# Altium schematic sheet Sheet1.SchDoc
size A2
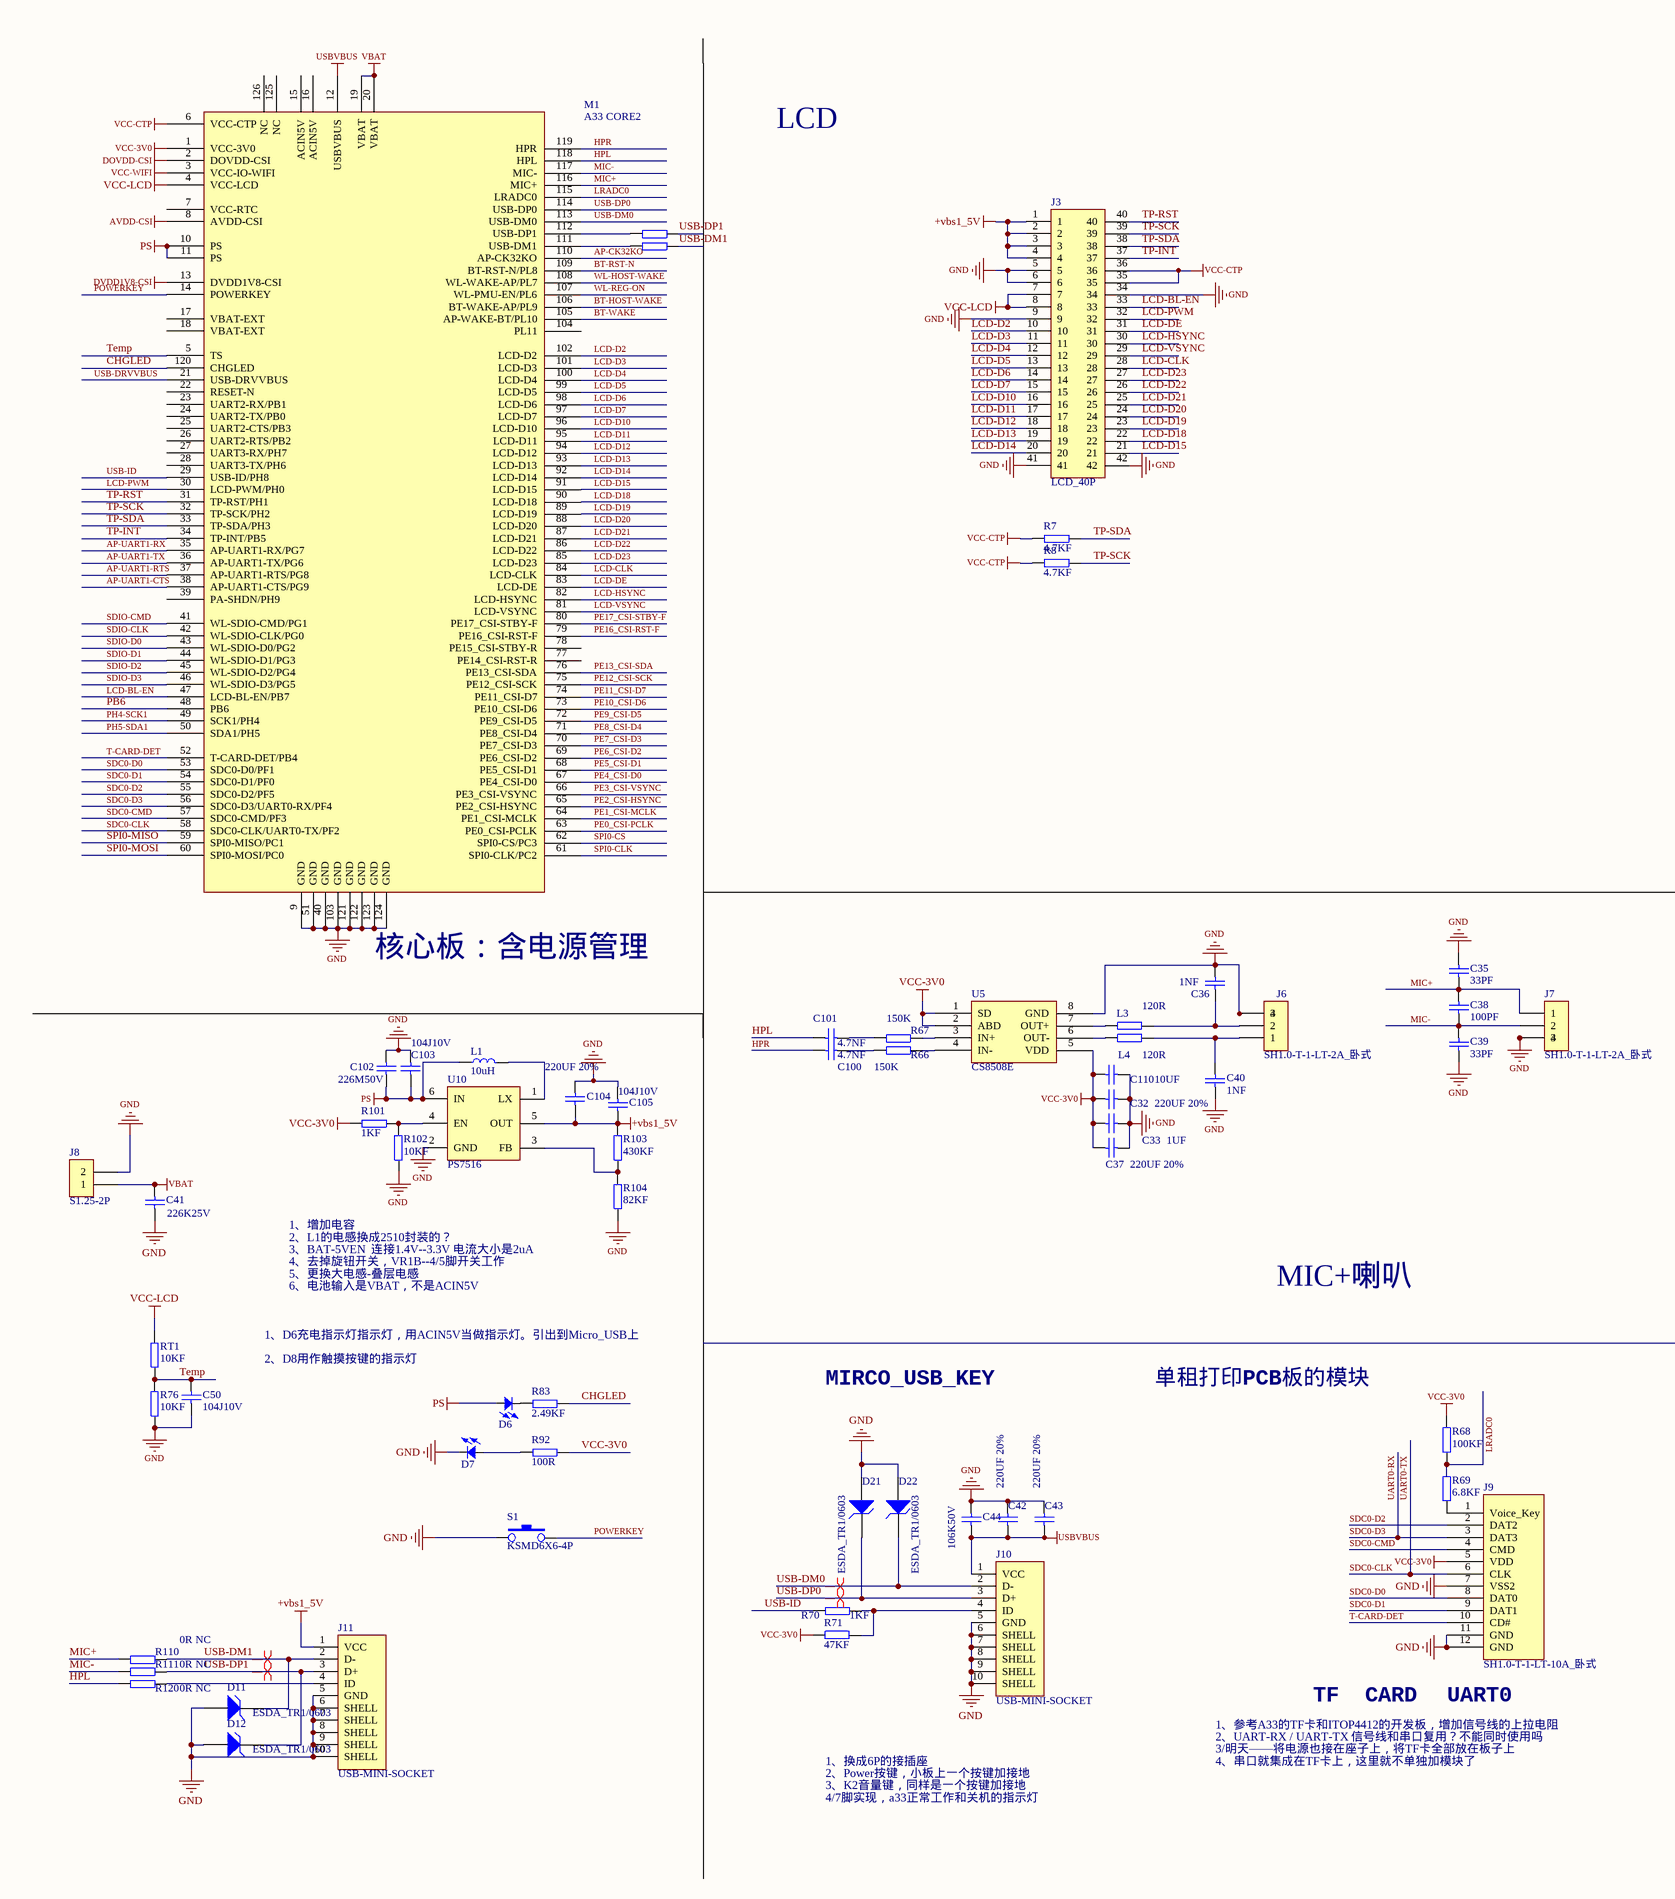
[diagram p0: Sheet1.SchDoc, left]
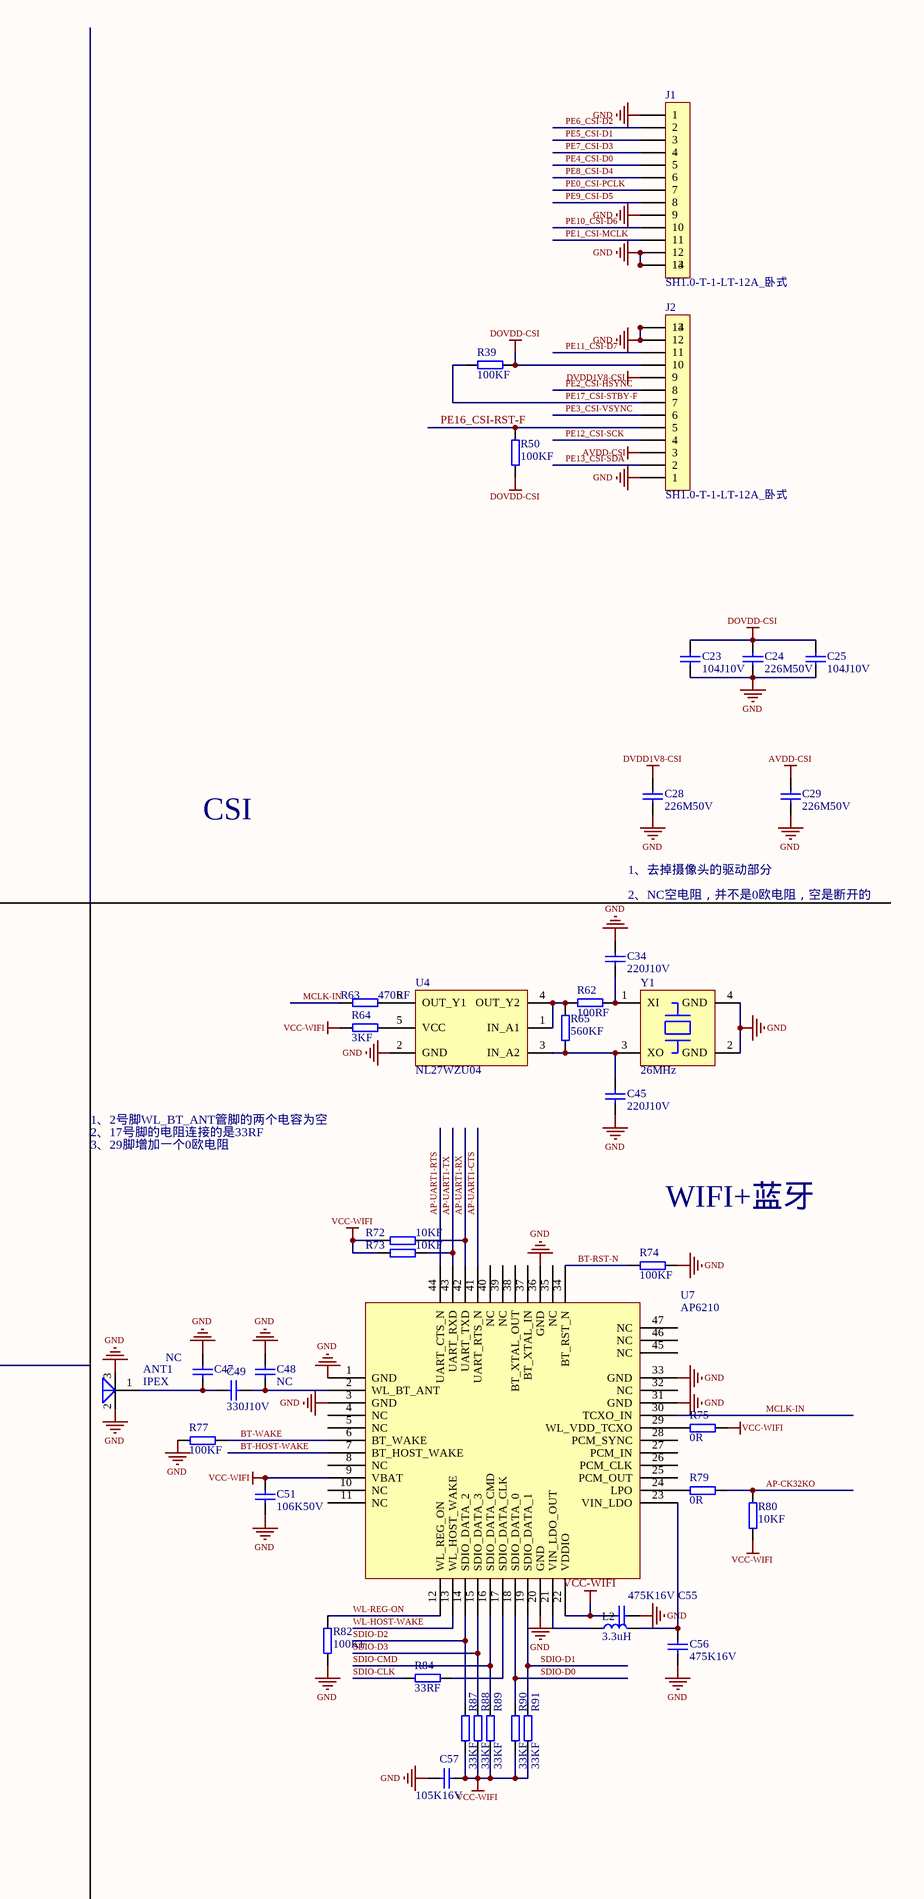
[diagram p1: Sheet1.SchDoc, right]

## Parts
ANT1  IPEX  [J-IPEX]
C23  104J10V  [C0402]
C24  226M50V  [C0805]
C25  104J10V  [C0402]
C28  226M50V  [C0805]
C29  226M50V  [C0805]
C32  220UF 20%  [C1206]
C33  1UF  [C0402]
C34  220J10V  [C0402]
C35  33PF  [C0402]
C36  1NF  [C0402]
C37  220UF 20%  [C1206]
C38  100PF  [C0402]
C39  33PF  [C0402]
C40  1NF  [C0402]
C41  226K25V  [C0805]
C42  220UF 20%  [C1206]
C43  220UF 20%  [C1206]
C44  106K50V  [C0603]
C45  220J10V  [C0402]
C47  NC  [C0402]
C48  NC  [C0402]
C49  330J10V  [C0402]
C50  104J10V  [C0402]
C51  106K50V  [C0603]
C55  475K16V  [C0603]
C56  475K16V  [C0603]
C57  105K16V  [C0603]
C100  4.7NF  [C0603]
C101  4.7NF  [C0603]
C102  226M50V  [C0805]
C103  104J10V  [C0402]
C104  220UF 20%  [C1206]
C105  104J10V  [C0402]
C110  10UF  [C0603]
D6  发光二极管  [LEDΦ5-H12]  (value not drawn)
D7  发光二极管  [LEDΦ5-H12]  (value not drawn)
D11  ESDA_TR1/0603  [HS_0603D]
D12  ESDA_TR1/0603  [HS_0603D]
D21  ESDA_TR1/0603  [HS_0603D]
D22  ESDA_TR1/0603  [HS_0603D]
J1  SH1.0-T-1-LT-12A_卧式  [J-SH1.0-T-1-LT-12A_卧式]
J2  SH1.0-T-1-LT-12A_卧式  [J-SH1.0-T-1-LT-12A_卧式]
J3  LCD_40P  [LCD P40]
J6  SH1.0-T-1-LT-2A_卧式  [J-SH1.0-T-1-LT-2A_卧式]
J7  SH1.0-T-1-LT-2A_卧式  [J-SH1.0-T-1-LT-2A_卧式]
J8  S1.25-2P  [S1.25-2P]
J9  SH1.0-T-1-LT-10A_卧式  [J-SH1.0-T-1-LT-10A_卧式]
J10  USB-MINI-SOCKET  [MICRO-USB - 5.9]
J11  USB-MINI-SOCKET  [MICRO-USB - 5.9]
L1  10uH  [L-2520]
L2  3.3uH  [L0805]
L3  120R  [R0603]
L4  120R  [R0603]
M1  A33 CORE2  [A33-CORE2]
R7  4.7KF  [R0402]
R8  4.7KF  [R0402]
R39  100KF  [R0603]
R50  100KF  [R0603]
R62  100RF  [R0603]
R63  470RF  [R0603]
R64  3KF  [R0603]
R65  560KF  [R0603]
R66  150K  [R0603]
R67  150K  [R0603]
R68  100KF  [R0603]
R69  6.8KF  [R0603]
R70  1KF  [R0603]
R71  47KF  [R0603]
R72  10KF  [R0603]
R73  10KF  [R0603]
R74  100KF  [R0603]
R75  0R  [R0603]
R76  10KF  [R0603]
R77  100KF  [R0603]
R79  0R  [R0603]
R80  10KF  [R0603]
R82  100KF  [R0603]
R83  2.49KF  [R0603]
R84  33RF  [R0603]
R87  33KF  [R0603]
R88  33KF  [R0603]
R89  33KF  [R0603]
R90  33KF  [R0603]
R91  33KF  [R0603]
R92  100R  [R0603]
R101  1KF  [R0603]
R102  10KF  [R0603]
R103  430KF  [R0603]
R104  82KF  [R0603]
R110  0R NC  [R0603]
R111  0R NC  [R0603]
R112  0R  NC  [R0603]  (value not drawn)
R113  0R  NC  [R0603]  (value not drawn)
R120  0R NC  [R0603]
RT1  10KF  [0402]
S1  KSMD6X6-4P  [SW2-6*6H]
U4  NL27WZU04  [U-TSOP-6]
U5  CS8508E  [SO-8]
U7  AP6210  [AP6210]
U10  PS7516  [U-SOT-23-6]
Y1  26MHz  [Y-CPX-32GA-4P]

## Nets
+vbs1_5V: C104.1 C105.2 J3.1 J3.2 J3.3 J3.4 J11.1(VCC) R103.2 U10.5(OUT)
AVDD-CSI: C29.1 J2.3 M1.8(AVDD-CSI)
DOVDD-CSI: C23.1 C24.1 C25.1 J2.10 M1.2(DOVDD-CSI) R39.2 R50.1
DVDD1V8-CSI: C28.1 J2.9 M1.13(DVDD1V8-CSI)
GND: ANT1.2 ANT1.3 C23.2 C24.2 C25.2 C28.2 C29.2 C32.1 C33.1 C34.2 C35.1 C36.2 C37.1 C39.2 C40.2 C41.2 C42.2 C43.2 C44.1 C45.2 C47.1 C48.1 C50.2 C51.2 C55.1 C56.1 C57.2 C102.2 C103.1 C104.2 C105.1 C110.2 D7.K D11.1(A) D12.1(A) D21.1(A) D22.1(A) J1.1 J1.9 J1.12 J1.13 J1.14 J2.1 J2.12 J2.13 J2.14 J3.5 J3.6 J3.9 J3.34 J3.41 J3.42 J6.3 J6.4 J7.3 J7.4 J8.2 J9.7(VSS2) J9.11(GND) J9.12(GND) J10.5(GND) J10.6(SHELL) J10.7(SHELL) J10.8(SHELL) J10.9(SHELL) J10.10(SHELL) J11.5(GND) J11.6(SHELL) J11.7(SHELL) J11.8(SHELL) J11.9(SHELL) J11.10(SHELL) M1.9(GND) M1.40(GND) M1.51(GND) M1.103(GND) M1.121(GND) M1.122(GND) M1.123(GND) M1.124(GND) R74.2 R76.1 R77.2 R82.2 R102.1 R104.1 S1.1 U4.2(GND) U5.8(GND) U7.1(GND) U7.3(GND) U7.20(GND) U7.31(GND) U7.33(GND) U7.36(GND) U10.2(GND) Y1.2(GND) Y1.4(GND)
PS: C102.1 C103.2 D6.A L1.1 M1.10(PS) M1.11(PS) U10.6(IN)
USBVBUS: C42.1 C43.1 C44.2 J10.1(VCC) M1.12(USBVBUS)
VBAT: C41.1 J8.1 M1.19(VBAT) M1.20(VBAT)
VCC-3V0: C32.2 C33.2 C37.2 C110.1 J9.5(VDD) M1.1(VCC-3V0) R68.1 R71.2 R92.2 R101.1 U5.1(SD) U5.2(ABD) U5.5(VDD)
VCC-CTP: J3.35 J3.36 M1.6(VCC-CTP) R7.1 R8.1
VCC-LCD: J3.7 J3.8 M1.4(VCC-LCD) RT1.2
VCC-WIFI: C51.1 C55.2 C57.1 M1.3(VCC-IO-WIFI) R64.1 R72.1 R73.1 R75.2 R80.1 R87.1 R88.1 R89.1 R90.1 R91.1 U7.9(VBAT) U7.22(VDDIO)
AP-CK32KO: M1.110(AP-CK32KO) R79.2 R80.2
AP-UART1-CTS: M1.38(AP-UART1-CTS/PG9) U7.41(UART_RTS_N)
AP-UART1-RTS: M1.37(AP-UART1-RTS/PG8) U7.44(UART_CTS_N)
AP-UART1-RX: M1.35(AP-UART1-RX/PG7) R72.2 U7.42(UART_TXD)
AP-UART1-TX: M1.36(AP-UART1-TX/PG6) R73.2 U7.43(UART_RXD)
BT-HOST-WAKE: M1.106(BT-WAKE-AP/PL9) U7.7(BT_HOST_WAKE)
BT-RST-N: M1.109(BT-RST-N/PL8) R74.1 U7.34(BT_RST_N)
BT-WAKE: M1.105(AP-WAKE-BT/PL10) R77.1 U7.6(BT_WAKE)
CHGLED: M1.120(CHGLED) R83.2
HPL: C101.1 M1.118(HPL) R120.1
HPR: C100.1 M1.119(HPR)
LCD-BL-EN: J3.33 M1.47(LCD-BL-EN/PB7)
LCD-CLK: J3.28 M1.84(LCD-CLK)
LCD-D2: J3.10 M1.102(LCD-D2)
LCD-D3: J3.11 M1.101(LCD-D3)
LCD-D4: J3.12 M1.100(LCD-D4)
LCD-D5: J3.13 M1.99(LCD-D5)
LCD-D6: J3.14 M1.98(LCD-D6)
LCD-D7: J3.15 M1.97(LCD-D7)
LCD-D10: J3.16 M1.96(LCD-D10)
LCD-D11: J3.17 M1.95(LCD-D11)
LCD-D12: J3.18 M1.94(LCD-D12)
LCD-D13: J3.19 M1.93(LCD-D13)
LCD-D14: J3.20 M1.92(LCD-D14)
LCD-D15: J3.21 M1.91(LCD-D15)
LCD-D18: J3.22 M1.90(LCD-D18)
LCD-D19: J3.23 M1.89(LCD-D19)
LCD-D20: J3.24 M1.88(LCD-D20)
LCD-D21: J3.25 M1.87(LCD-D21)
LCD-D22: J3.26 M1.86(LCD-D22)
LCD-D23: J3.27 M1.85(LCD-D23)
LCD-DE: J3.31 M1.83(LCD-DE)
LCD-HSYNC: J3.30 M1.82(LCD-HSYNC)
LCD-PWM: J3.32 M1.30(LCD-PWM/PH0)
LCD-VSYNC: J3.29 M1.81(LCD-VSYNC)
LRADC0: M1.115(LRADC0) R68.2 R69.1
MCLK-IN: R63.1 U7.30(TCXO_IN)
MIC+: C35.2 C38.1 J7.1 M1.116(MIC+) R110.1
MIC-: C38.2 C39.1 J7.2 M1.117(MIC-) R111.1
PB6: M1.48(PB6)
PE0_CSI-PCLK: J1.7 M1.63(PE0_CSI-PCLK)
PE1_CSI-MCLK: J1.11 M1.64(PE1_CSI-MCLK)
PE2_CSI-HSYNC: J2.8 M1.65(PE2_CSI-HSYNC)
PE3_CSI-VSYNC: J2.6 M1.66(PE3_CSI-VSYNC)
PE4_CSI-D0: J1.5 M1.67(PE4_CSI-D0)
PE5_CSI-D1: J1.3 M1.68(PE5_CSI-D1)
PE6_CSI-D2: J1.2 M1.69(PE6_CSI-D2)
PE7_CSI-D3: J1.4 M1.70(PE7_CSI-D3)
PE8_CSI-D4: J1.6 M1.71(PE8_CSI-D4)
PE9_CSI-D5: J1.8 M1.72(PE9_CSI-D5)
PE10_CSI-D6: J1.10 M1.73(PE10_CSI-D6)
PE11_CSI-D7: J2.11 M1.74(PE11_CSI-D7)
PE12_CSI-SCK: J2.4 M1.75(PE12_CSI-SCK)
PE13_CSI-SDA: J2.2 M1.76(PE13_CSI-SDA)
PE16_CSI-RST-F: J2.5 M1.79(PE16_CSI-RST-F) R50.2
PE17_CSI-STBY-F: J2.7 M1.80(PE17_CSI-STBY-F) R39.1
PH4-SCK1: M1.49(SCK1/PH4)
PH5-SDA1: M1.50(SDA1/PH5)
POWERKEY: M1.14(POWERKEY) S1.2
SDC0-CLK: J9.6(CLK) M1.58(SDC0-CLK/UART0-TX/PF2)  [also labelled UART0-TX]
SDC0-CMD: J9.4(CMD) M1.57(SDC0-CMD/PF3)
SDC0-D0: J9.8(DAT0) M1.53(SDC0-D0/PF1)
SDC0-D1: J9.9(DAT1) M1.54(SDC0-D1/PF0)
SDC0-D2: J9.2(DAT2) M1.55(SDC0-D2/PF5)
SDC0-D3: J9.3(DAT3) M1.56(SDC0-D3/UART0-RX/PF4)  [also labelled UART0-RX]
SDIO-CLK: M1.42(WL-SDIO-CLK/PG0) R84.2
SDIO-CMD: M1.41(WL-SDIO-CMD/PG1) R89.2 U7.16(SDIO_DATA_CMD)
SDIO-D0: M1.43(WL-SDIO-D0/PG2) R90.2 U7.18(SDIO_DATA_0)
SDIO-D1: M1.44(WL-SDIO-D1/PG3) R91.2 U7.19(SDIO_DATA_1)
SDIO-D2: M1.45(WL-SDIO-D2/PG4) R87.2 U7.14(SDIO_DATA_2)
SDIO-D3: M1.46(WL-SDIO-D3/PG5) R88.2 U7.15(SDIO_DATA_3)
SPI0-CLK: M1.61(SPI0-CLK/PC2)
SPI0-CS: M1.62(SPI0-CS/PC3)
SPI0-MISO: M1.59(SPI0-MISO/PC1)
SPI0-MOSI: M1.60(SPI0-MOSI/PC0)
T-CARD-DET: J9.10(CD#) M1.52(T-CARD-DET/PB4)
Temp: C50.1 M1.5(TS) R76.2 RT1.1
TP-INT: J3.37 M1.34(TP-INT/PB5)
TP-RST: J3.40 M1.31(TP-RST/PH1)
TP-SCK: J3.39 M1.32(TP-SCK/PH2) R8.2
TP-SDA: J3.38 M1.33(TP-SDA/PH3) R7.2
USB-DM0: D22.2(K) J10.2(D-) M1.113(USB-DM0)
USB-DM1: D11.2(K) J11.2(D-) R110.2 R113.2
USB-DP0: D21.2(K) J10.3(D+) M1.114(USB-DP0)
USB-DP1: D12.2(K) J11.3(D+) R111.2 R112.2
USB-DRVVBUS: M1.21(USB-DRVVBUS)
USB-ID: M1.29(USB-ID/PH8) R70.1
WL-HOST-WAKE: M1.108(WL-WAKE-AP/PL7) U7.13(WL_HOST_WAKE)
WL-REG-ON: M1.107(WL-PMU-EN/PL6) R82.1 U7.12(WL_REG_ON)
NetANT1_1: ANT1.1(W) C47.2 C49.2
NetC34_1: C34.1 R62.2 Y1.1(XI)
NetC36_1: C36.1 J6.2 L3.1
NetC40_1: C40.1 J6.1 L4.1
NetC45_1: C45.1 R65.1 U4.3(IN_A2) Y1.3(XO)
NetC48_2: C48.2 C49.1 U7.2(WL_BT_ANT)
NetC56_2: C56.2 L2.2 U7.23(VIN_LDO)
NetC100_2: C100.2 R66.1
NetC101_2: C101.2 R67.1
NetD6_K: D6.K R83.1
NetD7_A: D7.A R92.1
NetJ9_1: J9.1(Voice_Key) R69.2
NetJ10_4: J10.4(ID) R70.2 R71.1
NetJ11_4: J11.4(ID) R120.2
NetL1_2: L1.2 U10.1(LX)
NetL2_1: L2.1 U7.21(VIN_LDO_OUT)
NetL3_2: L3.2 U5.7(OUT+)
NetL4_2: L4.2 U5.6(OUT-)
NetM1_111: M1.111(USB-DM1) R113.1
NetM1_112: M1.112(USB-DP1) R112.1
NetR62_1: R62.1 R65.2 U4.1(IN_A1) U4.4(OUT_Y2)
NetR63_2: R63.2 U4.6(OUT_Y1)
NetR64_2: R64.2 U4.5(VCC)
NetR66_2: R66.2 U5.4(IN-)
NetR67_2: R67.2 U5.3(IN+)
NetR75_1: R75.1 U7.29(WL_VDD_TCXO)
NetR79_1: R79.1 U7.24(LPO)
NetR84_1: R84.1 U7.17(SDIO_DATA_CLK)
NetR101_2: R101.2 R102.2 U10.4(EN)
NetR103_1: R103.1 R104.2 U10.3(FB)

Not connected (* = marked no-connect by the designer): M1 7(VCC-RTC) 15(ACIN5V) 16(ACIN5V) 17(VBAT-EXT) 18(VBAT-EXT) 22(RESET-N) 23(UART2-RX/PB1) 24(UART2-TX/PB0) 25(UART2-CTS/PB3) 26(UART2-RTS/PB2) 27(UART3-RX/PH7) 28(UART3-TX/PH6) 39(PA-SHDN/PH9) 77(PE14_CSI-RST-R) 78(PE15_CSI-STBY-R) 104(PL11) 125(NC) 126(NC); U7 4(NC) 5(NC) 8(NC) 10(NC) 11(NC) 25(PCM_OUT) 26(PCM_CLK) 27(PCM_IN) 28(PCM_SYNC) 32(NC) 35(NC) 37(BT_XTAL_IN) 38(BT_XTAL_OUT) 39(NC) 40(NC) 45(NC) 46(NC) 47(NC)

## Layout directives
differential pair: USB-DM0, USB-DM1, USB-DP0, USB-DP1

## Notes on the sheet
- LCD
- CSI
- 1、去掉摄像头的驱动部分
- 2、NC空电阻，并不是0欧电阻，空是断开的
- (near M1) 核心板：含电源管理
- 1、2号脚WL_BT_ANT管脚的两个电容为空
- 2、17号脚的电阻连接的是33RF
- 3、29脚增加一个0欧电阻
- WIFI+蓝牙
- 1、增加电容
- 2、L1的电感换成2510封装的？
- 3、BAT-5VEN  连接1.4V--3.3V 电流大小是2uA
- 4、去掉旋钮开关，VR1B--4/5脚开关工作
- 5、更换大电感-叠层电感
- 6、电池输入是VBAT，不是ACIN5V
- MIC+喇叭
- 1、D6充电指示灯指示灯，用ACIN5V当做指示灯。引出到Micro_USB上
- 2、D8用作触摸按键的指示灯
- MIRCO_USB_KEY
- 单租打印PCB板的模块
- 1、参考A33的TF卡和ITOP4412的开发板，增加信号线的上拉电阻
- 2、UART-RX / UART-TX 信号线和串口复用？不能同时使用吗
- 3/明天——将电源也接在座子上，将TF卡全部放在板子上
- TF  CARD
- (near J9) UART0
- 1、换成6P的接插座
- 2、Power按键，小板上一个按键加接地
- 3、K2音量键，同样是一个按键加接地
- 4/7脚实现，a33正常工作和关机的指示灯
- 4、串口就集成在TF卡上，这里就不单独加模块了

## Library data of the parts
ANT1 = J-IPEX: 天线接口IPEX
C23 C25 C35 C38 C39 C50 C103 C105 = C0402X7R-104J10V: 贴片电容-陶瓷; 规格型号: 100nF±5%_10V_X7R_C0402; 生产商: 风华 三星; 供应商: *; 备注: *
C24 C28 C29 C102 = C0805Y5V-226M50V: 贴片电容-陶瓷; 规格型号: 22uF±20%_50V_Y5V_C0805; 生产商: 风华 三星; 供应商: *; 备注: *
C32 C37 C42 C43 C104 = C1206-A型 极性电容: C 1206钽电容 --220UF 10V 3216 A型 有极性电容 3.2mm X 1.6mm; 参数: C 1206钽电容 --220UF 20% 10V 3216 A型 有极性 白色为正 电容 3.2mm X 1.6mm
C33 = C0402X7R-105J10V: 贴片电容-陶瓷; 规格型号: 1uF±J%_10V_X7R_C0402; 生产商: 风华 三星; 供应商: *; 备注: *
C34 C36 C40 C45 C47 C48 = C0402X7R-220J10V: 贴片电容-陶瓷; 规格型号: 22pF±5%_10V_X7R_C0402; 生产商: 风华 三星; 供应商: *; 备注: *
C41 = C0805X7R-226K25V: 贴片电容-陶瓷; 规格型号: 22uF±10%_25V_X7R_C0805; 生产商: 风华 三星; 供应商: *; 备注: *
C44 C51 = C0603X7R-106K50V: 贴片电容-陶瓷; 规格型号: 10uF±10%_50V_X7R_C0603; 生产商: 风华 三星; 供应商: *; 备注: *
C49 = C0402X7R-330J10V: 贴片电容-陶瓷; 规格型号: 33pF±5%_10V_X7R_C0402; 生产商: 风华 三星; 供应商: *; 备注: *
C55 C56 = C0603X7R-475K16V: 贴片电容-陶瓷; 规格型号: 4.7uF±10%_16V_X7R_C0603; 生产商: 风华 三星; 供应商: *; 备注: *
C57 = C0603X7R-105K16V: 贴片电容-陶瓷; 规格型号: 1uF±10%_16V_X7R_C0603; 生产商: 风华 三星; 供应商: *; 备注: *
C100 C101 C110 = C0603X7R-330J25V: 贴片电容-陶瓷; 规格型号: 33pF±5%_25V_X7R_C0603; 生产商: 风华 三星; 供应商: *; 备注: *
D11 D12 D21 D22 = D Zener: Zener Diode; Published: *; LatestRevisionDate: *; LatestRevisionNote: *; PackageReference: *; Publisher: *
J8 = O-CP-840-2P: 定制铜排; 货品编码: 样品无编码; 供应商: *; 规格型号: CP-840-2P; 备注: *
J10 J11 = J-USB-MINI-SOCKET: USB-A卧式插座; 供应商: *; 备注: *
L1 = L-2520-10uH: 贴片电感-层叠; 叠层电感: 2.5*2*1.8
L2 = L-0805-3.3uH: 贴片电感-层叠; 规格型号: L0805-3.3uH; 生产商: *; 供应商: *; 备注: *
L3 L4 R71 = R0603-47KF: 贴片电阻-通用; 生产商: 厚声 国巨; 规格型号: 47K±1%_1/10W_±200ppm_R0603; 货品编码: 无样品无编码; 备注: *; 供应商: *
R7 R8 = R0402-4.7KF: 贴片电阻-通用
R39 R50 R68 R74 R77 R82 = R0603-100KF: 贴片电阻-通用; 生产商: 厚声 国巨; 规格型号: 100K±1%_1/10W_±200ppm_R0603; 货品编码: 无样品无编码; 备注: *; 供应商: *
R62 = R0603-100RF: 贴片电阻-通用; 生产商: 厚声 国巨; 规格型号: 100R±1%_1/10W_±200ppm_R0603; 备注: *; 供应商: *
R63 = R0603-470RF: 贴片电阻-通用; 生产商: 厚声 国巨; 规格型号: 470R±1%_1/10W_±200ppm_R0603; 货品编码: 无样品无编码; 备注: *; 供应商: *
R64 R83 = R0603-3KF: 贴片电阻-通用; 生产商: 厚声 国巨; 规格型号: 3K±1%_1/10W_±200ppm_R0603; 货品编码: 无样品无编码; 备注: *; 供应商: *
R65 = R0603-560KF: 贴片电阻-通用; 生产商: 厚声 国巨; 规格型号: 560K±1%_1/10W_±200ppm_R0603; 备注: *; 供应商: *
R66 R67 R72 R73 R76 R80 R102 R112 R113 = R0603-10KF: 贴片电阻-通用; 生产商: 厚声 国巨; 规格型号: 10K±1%_1/10W_±200ppm_R0603; 备注: *; 供应商: *
R69 = R0603-6.8KF: 贴片电阻-通用; 生产商: 厚声 国巨; 规格型号: 6.8K±1%_1/10W_±200ppm_R0603; 货品编码: 无样品无编码; 备注: *; 供应商: *
R70 R101 = R0603-1KF: 贴片电阻-通用; 生产商: 厚声 国巨; 规格型号: 1K±1%_1/10W_±200ppm_R0603; 货品编码: 无样品无编码; 备注: *; 供应商: *
R75 R79 = R0603-0R: 贴片电阻-通用; 生产商: 厚声 国巨; 规格型号: 0R_1/10W_±200ppm_R0603; 货品编码: 无样品无编码; 备注: *; 供应商: *
R84 = R0603-33RF: 贴片电阻-通用; 生产商: 厚声 国巨; 规格型号: 33R±1%_1/10W_±200ppm_R0603; 货品编码: 无样品无编码; 备注: *; 供应商: *
R87-R91 = R0603-33KF: 贴片电阻-通用; 生产商: 厚声 国巨; 规格型号: 33K±1%_1/10W_±200ppm_R0603; 备注: *; 供应商: *
R92 R110 R111 R120 = R0603-2KF: 贴片电阻-通用; 生产商: 厚声 国巨; 规格型号: 2K±1%_1/10W_±200ppm_R0603; 备注: *; 供应商: *
R103 = R0603-430KF: 贴片电阻-通用; 生产商: 厚声 国巨; 规格型号: 430K±1%_1/10W_±200ppm_R0603; 备注: *; 供应商: *
R104 = R0603-82KF: 贴片电阻-通用; 生产商: 厚声 国巨; 规格型号: 82K±1%_1/10W_±200ppm_R0603; 备注: *; 供应商: *
RT1 = R0603-10KF: 贴片电阻-通用; 生产商: 厚声 国巨; 规格型号: 10K±1%_1/10W_±200ppm_R0402; 备注: *; 供应商: *
S1 = S-KSMD6X6-4P: 轻触按键; 货品编码: 232013; 规格型号: 6x6 SMD贴片按键; 备注: *; 供应商: *; 生产商: *
Y1 = YC-26MHz: 晶振-贴片无源; 规格型号: 26MHz_贴片晶振3225; 生产商: *; 供应商: *; 备注: *